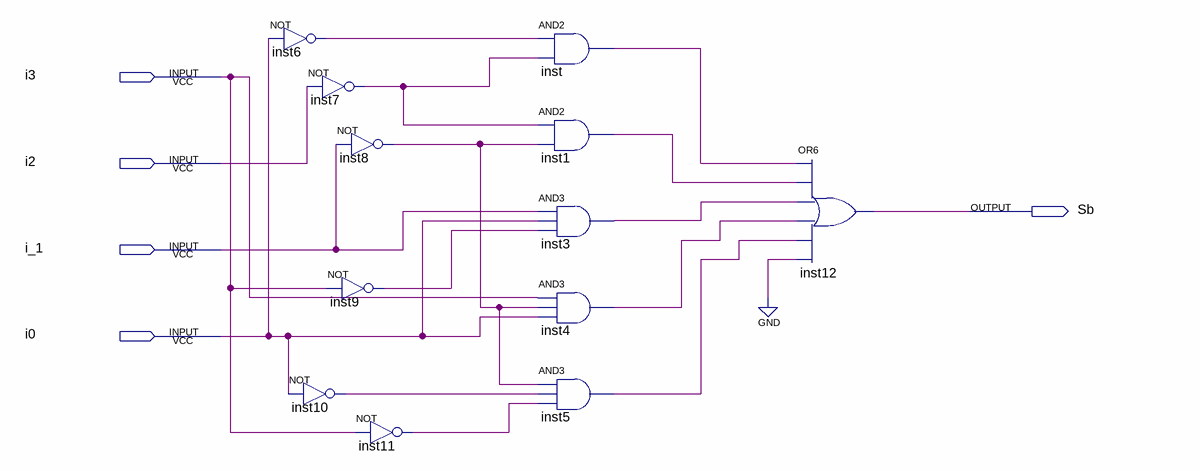
[diagram p0: schematic sheet]
// Quartus schematic lab05_b_top.bdf as structural Verilog: 12 symbols, 5 pins
module lab05_b_top (
  input  i3,
  input  i2,
  input  i_1,
  input  i0,
  output Sb
);

  wire inst1_out, inst3_out, inst4_out, inst5_out, inst6_out, inst7_out, inst8_out, inst9_out, inst10_out,
       inst11_out, inst_out;

  not inst6 (inst6_out, i0);
  not inst10 (inst10_out, i0);
  not inst7 (inst7_out, i2);
  not inst8 (inst8_out, i_1);
  not inst9 (inst9_out, i3);
  not inst11 (inst11_out, i3);
  and inst (inst_out, inst6_out, inst7_out);
  and inst1 (inst1_out, inst7_out, inst8_out);
  and inst3 (inst3_out, i_1, i0, inst9_out);
  and inst4 (inst4_out, i3, inst8_out, i0);
  and inst5 (inst5_out, inst8_out, inst10_out, inst11_out);
  or inst12 (Sb, inst_out, inst1_out, inst3_out, inst4_out, inst5_out, 1'b0);
endmodule
